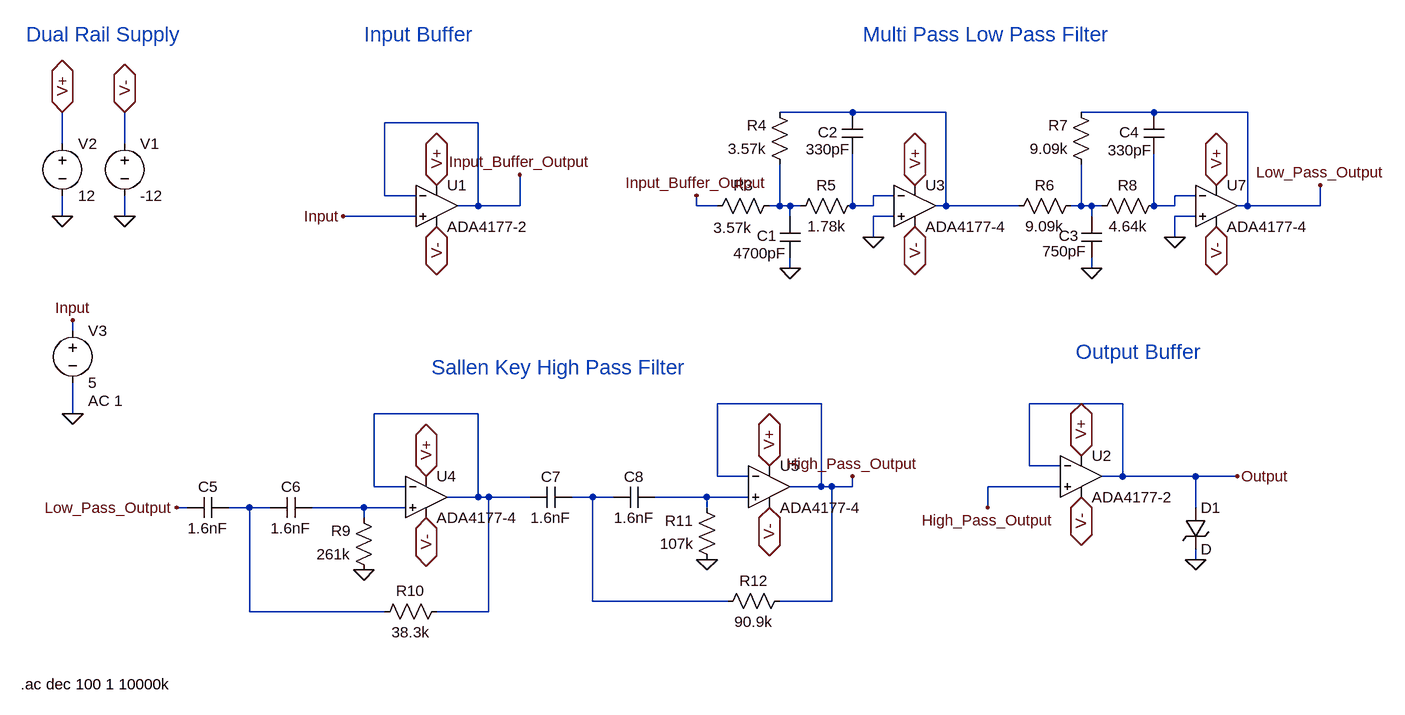
[diagram p0: schematic 8thOrderBandpassFilter.asc]
8thOrderBandpassFilter.asc, the LTspice schematic file:
Version 4.1
SHEET 1 1944 872
WIRE 480 -32 368 -32
WIRE 624 -32 480 -32
WIRE 944 -32 832 -32
WIRE 1088 -32 944 -32
WIRE -96 -16 -240 -16
WIRE -736 16 -736 -32
WIRE -640 16 -640 -32
WIRE -240 96 -240 -16
WIRE -192 96 -240 96
WIRE 544 96 512 96
WIRE 1008 96 976 96
WIRE -96 112 -96 -16
WIRE -96 112 -128 112
WIRE -32 112 -32 64
WIRE -32 112 -96 112
WIRE 240 112 240 96
WIRE 272 112 240 112
WIRE 368 112 368 48
WIRE 368 112 352 112
WIRE 384 112 368 112
WIRE 400 112 384 112
WIRE 480 112 480 32
WIRE 512 112 512 96
WIRE 512 112 480 112
WIRE 624 112 624 -32
WIRE 624 112 608 112
WIRE 736 112 624 112
WIRE 832 112 832 48
WIRE 832 112 816 112
WIRE 848 112 832 112
WIRE 864 112 848 112
WIRE 944 112 944 32
WIRE 976 112 976 96
WIRE 976 112 944 112
WIRE 1088 112 1088 -32
WIRE 1088 112 1072 112
WIRE 1200 112 1200 80
WIRE 1200 112 1088 112
WIRE -736 128 -736 96
WIRE -640 128 -640 96
WIRE -192 128 -304 128
WIRE 384 128 384 112
WIRE 544 128 512 128
WIRE 848 128 848 112
WIRE 1008 128 976 128
WIRE 512 160 512 128
WIRE 976 160 976 128
WIRE 384 208 384 192
WIRE 848 208 848 192
WIRE -720 304 -720 288
WIRE 432 416 272 416
WIRE 896 416 752 416
WIRE -720 432 -720 384
WIRE -96 432 -256 432
WIRE 752 512 752 416
WIRE 800 512 752 512
WIRE 272 528 272 416
WIRE 320 528 272 528
WIRE 896 528 896 416
WIRE 896 528 864 528
WIRE 1008 528 896 528
WIRE 1072 528 1008 528
WIRE -256 544 -256 432
WIRE -208 544 -256 544
WIRE 432 544 432 416
WIRE 432 544 384 544
WIRE 448 544 432 544
WIRE 480 544 480 528
WIRE 480 544 448 544
WIRE 800 544 688 544
WIRE -96 560 -96 432
WIRE -96 560 -144 560
WIRE -80 560 -96 560
WIRE -16 560 -80 560
WIRE 80 560 48 560
WIRE 112 560 80 560
WIRE 256 560 176 560
WIRE 320 560 256 560
WIRE -544 576 -560 576
WIRE -448 576 -480 576
WIRE -416 576 -448 576
WIRE -272 576 -352 576
WIRE -208 576 -272 576
WIRE 256 576 256 560
WIRE 688 576 688 544
WIRE 1008 576 1008 528
WIRE -272 592 -272 576
WIRE 1008 656 1008 640
WIRE 80 720 80 560
WIRE 288 720 80 720
WIRE 448 720 448 544
WIRE 448 720 368 720
WIRE -448 736 -448 576
WIRE -240 736 -448 736
WIRE -80 736 -80 560
WIRE -80 736 -160 736
FLAG -736 128 0
FLAG -640 128 0
FLAG -736 -32 V+
IOPIN -736 -32 BiDir
FLAG -640 -32 V-
IOPIN -640 -32 BiDir
FLAG -160 80 V+
IOPIN -160 80 BiDir
FLAG 576 80 V+
IOPIN 576 80 BiDir
FLAG -176 528 V+
IOPIN -176 528 BiDir
FLAG 832 496 V+
IOPIN 832 496 BiDir
FLAG -160 144 V-
IOPIN -160 144 BiDir
FLAG 576 144 V-
IOPIN 576 144 BiDir
FLAG -176 592 V-
IOPIN -176 592 BiDir
FLAG 832 560 V-
IOPIN 832 560 BiDir
FLAG -304 128 Input
FLAG 512 160 0
FLAG 384 208 0
FLAG 1040 80 V+
IOPIN 1040 80 BiDir
FLAG 1040 144 V-
IOPIN 1040 144 BiDir
FLAG 976 160 0
FLAG 848 208 0
FLAG -272 672 0
FLAG 1200 80 Low_Pass_Output
FLAG -560 576 Low_Pass_Output
FLAG -32 64 Input_Buffer_Output
FLAG 240 96 Input_Buffer_Output
FLAG 352 512 V+
IOPIN 352 512 BiDir
FLAG 352 576 V-
IOPIN 352 576 BiDir
FLAG 256 656 0
FLAG 1008 656 0
FLAG 1072 528 Output
FLAG 480 528 High_Pass_Output
FLAG 688 576 High_Pass_Output
FLAG -720 288 Input
FLAG -720 432 0
SYMBOL OpAmps\\ADA4177-4 576 112 R0
SYMATTR InstName U3
SYMBOL OpAmps\\ADA4177-4 -176 560 R0
SYMATTR InstName U4
SYMBOL OpAmps\\ADA4177-2 -160 112 R0
SYMATTR InstName U1
SYMBOL OpAmps\\ADA4177-2 832 528 R0
SYMATTR InstName U2
SYMBOL voltage -640 0 R0
WINDOW 123 24 124 Left 2
WINDOW 39 0 0 Left 0
SYMATTR InstName V1
SYMATTR Value -12
SYMBOL voltage -736 0 R0
WINDOW 123 24 124 Left 2
WINDOW 39 0 0 Left 0
SYMATTR InstName V2
SYMATTR Value 12
SYMBOL res 256 128 R270
WINDOW 0 32 56 VTop 2
WINDOW 3 -2 40 VBottom 2
SYMATTR InstName R3
SYMATTR Value 3.57k
SYMBOL res 384 64 R180
WINDOW 0 36 76 Left 2
WINDOW 3 36 40 Left 2
SYMATTR InstName R4
SYMATTR Value 3.57k
SYMBOL res 384 128 R270
WINDOW 0 32 56 VTop 2
WINDOW 3 0 56 VBottom 2
SYMATTR InstName R5
SYMATTR Value 1.78k
SYMATTR SpiceLine tol=1 pwr=1/8
SYMBOL cap 400 192 R180
WINDOW 0 36 34 Left 2
WINDOW 3 21 7 Left 2
SYMATTR InstName C1
SYMATTR Value 4700pF
SYMBOL cap 464 -32 R0
WINDOW 0 -37 31 Left 2
WINDOW 3 -56 57 Left 2
SYMATTR InstName C2
SYMATTR Value 330pF
SYMBOL OpAmps\\ADA4177-4 1040 112 R0
SYMATTR InstName U7
SYMBOL res 720 128 R270
WINDOW 0 32 56 VTop 2
WINDOW 3 0 56 VBottom 2
SYMATTR InstName R6
SYMATTR Value 9.09k
SYMBOL res 848 64 R180
WINDOW 0 36 76 Left 2
WINDOW 3 36 40 Left 2
SYMATTR InstName R7
SYMATTR Value 9.09k
SYMBOL res 848 128 R270
WINDOW 0 32 56 VTop 2
WINDOW 3 0 56 VBottom 2
SYMATTR InstName R8
SYMATTR Value 4.64k
SYMATTR SpiceLine tol=5 pwr=0.166
SYMBOL cap 864 192 R180
WINDOW 0 36 34 Left 2
WINDOW 3 23 10 Left 2
SYMATTR InstName C3
SYMATTR Value 750pF
SYMBOL cap 928 -32 R0
WINDOW 0 -37 31 Left 2
WINDOW 3 -55 58 Left 2
SYMATTR InstName C4
SYMATTR Value 330pF
SYMBOL res -256 752 R270
WINDOW 0 32 56 VTop 2
WINDOW 3 0 56 VBottom 2
SYMATTR InstName R10
SYMATTR Value 38.3k
SYMATTR SpiceLine tol=0.1 pwr=1/10
SYMBOL res -256 688 R180
WINDOW 0 36 76 Left 2
WINDOW 3 36 40 Left 2
SYMATTR InstName R9
SYMATTR Value 261k
SYMATTR SpiceLine tol=0.1 pwr=1/10
SYMBOL cap -480 560 R90
WINDOW 0 0 32 VBottom 2
WINDOW 3 32 32 VTop 2
SYMATTR InstName C5
SYMATTR Value 1.6nF
SYMBOL cap -352 560 R90
WINDOW 0 0 32 VBottom 2
WINDOW 3 32 32 VTop 2
SYMATTR InstName C6
SYMATTR Value 1.6nF
SYMBOL OpAmps\\ADA4177-4 352 544 R0
SYMATTR InstName U5
SYMBOL res 272 736 R270
WINDOW 0 32 56 VTop 2
WINDOW 3 0 56 VBottom 2
SYMATTR InstName R12
SYMATTR Value 90.9k
SYMATTR SpiceLine tol=1 pwr=1/10
SYMBOL res 272 672 R180
WINDOW 0 36 76 Left 2
WINDOW 3 36 40 Left 2
SYMATTR InstName R11
SYMATTR Value 107k
SYMATTR SpiceLine tol=0.5 pwr=1/10
SYMBOL cap 48 544 R90
WINDOW 0 0 32 VBottom 2
WINDOW 3 32 32 VTop 2
SYMATTR InstName C7
SYMATTR Value 1.6nF
SYMBOL cap 176 544 R90
WINDOW 0 0 32 VBottom 2
WINDOW 3 32 32 VTop 2
SYMATTR InstName C8
SYMATTR Value 1.6nF
SYMBOL TVSdiode 992 576 R0
SYMATTR InstName D1
SYMBOL voltage -720 288 R0
WINDOW 123 24 124 Left 2
WINDOW 39 0 0 Left 0
SYMATTR Value2 AC 1
SYMATTR InstName V3
SYMATTR Value 5
TEXT 496 -152 Left 3 ;Multi Pass Low Pass Filter
TEXT -272 -152 Left 3 ;Input Buffer
TEXT -792 -152 Left 3 ;Dual Rail Supply
TEXT -168 360 Left 3 ;Sallen Key High Pass Filter
TEXT 824 336 Left 3 ;Output Buffer
TEXT -800 848 Left 2 !.ac dec 100 1 10000k

The netlist it stands for:
* 8thOrderBandpassFilter.asc
* U3: ADA4177-4 (symbol OpAmps\ADA4177-4 not available, pins judged from their places): In+=0 In-=N002 V+=V+ V-=V- OUT=N001
* U4: ADA4177-4 (symbol OpAmps\ADA4177-4 not available, pins judged from their places): In+=N010 In-=N006 V+=V+ V-=V- OUT=N006
* U1: ADA4177-2 (symbol OpAmps\ADA4177-2 not available, pins judged from their places): In+=Input In-=Input_Buffer_Output V+=V+ V-=V- OUT=Input_Buffer_Output
* U2: ADA4177-2 (symbol OpAmps\ADA4177-2 not available, pins judged from their places): In+=High_Pass_Output In-=Output V+=V+ V-=V- OUT=Output
V1 V- 0 -12
V2 V+ 0 12
R3 Input_Buffer_Output N004 3.57k
R4 N004 N001 3.57k
R5 N004 N002 1.78k tol=1 pwr=1/8
C1 0 N004 4700pF
C2 N001 N002 330pF
* U7: ADA4177-4 (symbol OpAmps\ADA4177-4 not available, pins judged from their places): In+=0 In-=N003 V+=V+ V-=V- OUT=Low_Pass_Output
R6 N001 N005 9.09k
R7 N005 Low_Pass_Output 9.09k
R8 N005 N003 4.64k tol=5 pwr=0.166
C3 0 N005 750pF
C4 Low_Pass_Output N003 330pF
R10 N009 N006 38.3k tol=0.1 pwr=1/10
R9 0 N010 261k tol=0.1 pwr=1/10
C5 N009 Low_Pass_Output 1.6nF
C6 N010 N009 1.6nF
* U5: ADA4177-4 (symbol OpAmps\ADA4177-4 not available, pins judged from their places): In+=N008 In-=High_Pass_Output V+=V+ V-=V- OUT=High_Pass_Output
R12 N007 High_Pass_Output 90.9k tol=1 pwr=1/10
R11 0 N008 107k tol=0.5 pwr=1/10
C7 N007 N006 1.6nF
C8 N008 N007 1.6nF
D1 Output 0 D
V3 Input 0 5 AC 1
.model D D
.lib standard.dio
* Multi Pass Low Pass Filter
* Input Buffer
* Dual Rail Supply
* Sallen Key High Pass Filter
* Output Buffer
.ac dec 100 1 10000k
.backanno
.end